# Altium schematic sheet Master_Display.SchDoc
size A4; Organization: Altium Limited; Address1: L3, 12a Rodborough Rd; Address2: Frenchs Forest; Address3: NSW; Address4: Australia 2086
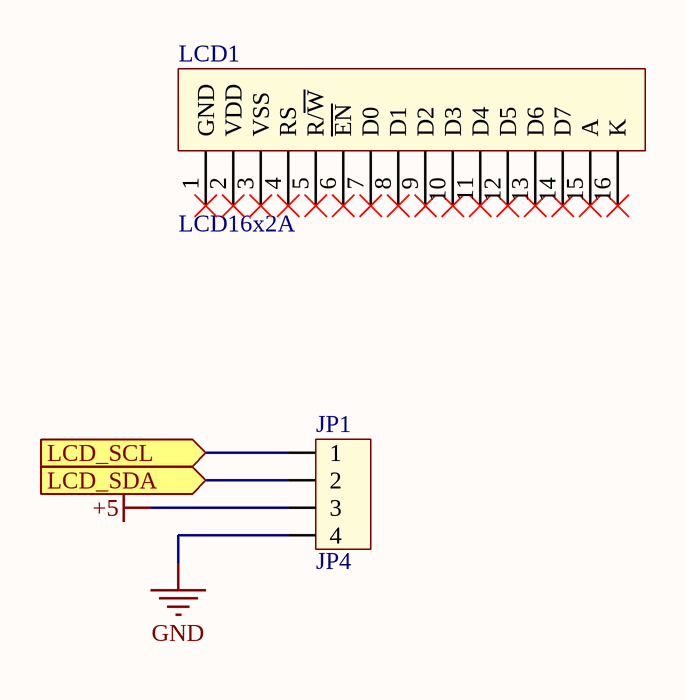
[diagram p0: Master_Display.SchDoc]

## Parts
JP1  JP4  [CON4]
LCD1  LCD16x2A  [LCD16X2N]

## Ports
LCD_SCL (in), LCD_SDA (in)

## Nets
+5: JP1.3
GND: JP1.4
LCD_SCL: JP1.1 ; port LCD_SCL
LCD_SDA: JP1.2 ; port LCD_SDA

Not connected (* = marked no-connect by the designer): LCD1 1(GND)* 2(VDD)* 3(VSS)* 4(RS)* 5(R/~{W})* 6(~{EN})* 7(D0)* 8(D1)* 9(D2)* 10(D3)* 11(D4)* 12(D5)* 13(D6)* 14(D7)* 15(A)* 16(K)*

## Notes on the sheet
- Labels drawn without touching a wire or pin: Page Contents:, Project:
- Size:
- Date:
- A4
- Ver:
- Time:
- Author:
- Checked by:
- File:

## Library data of the parts
JP1 = Con4: Connector 4; Value: Connector 4
LCD1 = LCD16x2: LCD dipslay 16 char, 2 line; Value: LCD16x2A